# Altium schematic sheet fpga.SCHDOC: FPGA Parts
size A3; Organization: Berne University of Applied Science; Address1: School of Engineering and; Address2: Information Technology; Address3: Quellgasse 21; Address4: CH-2501 Biel; Revision: 1.0; SheetNumber: 2; SheetTotal: 19; ApprovedBy: zem1; Author: zac1
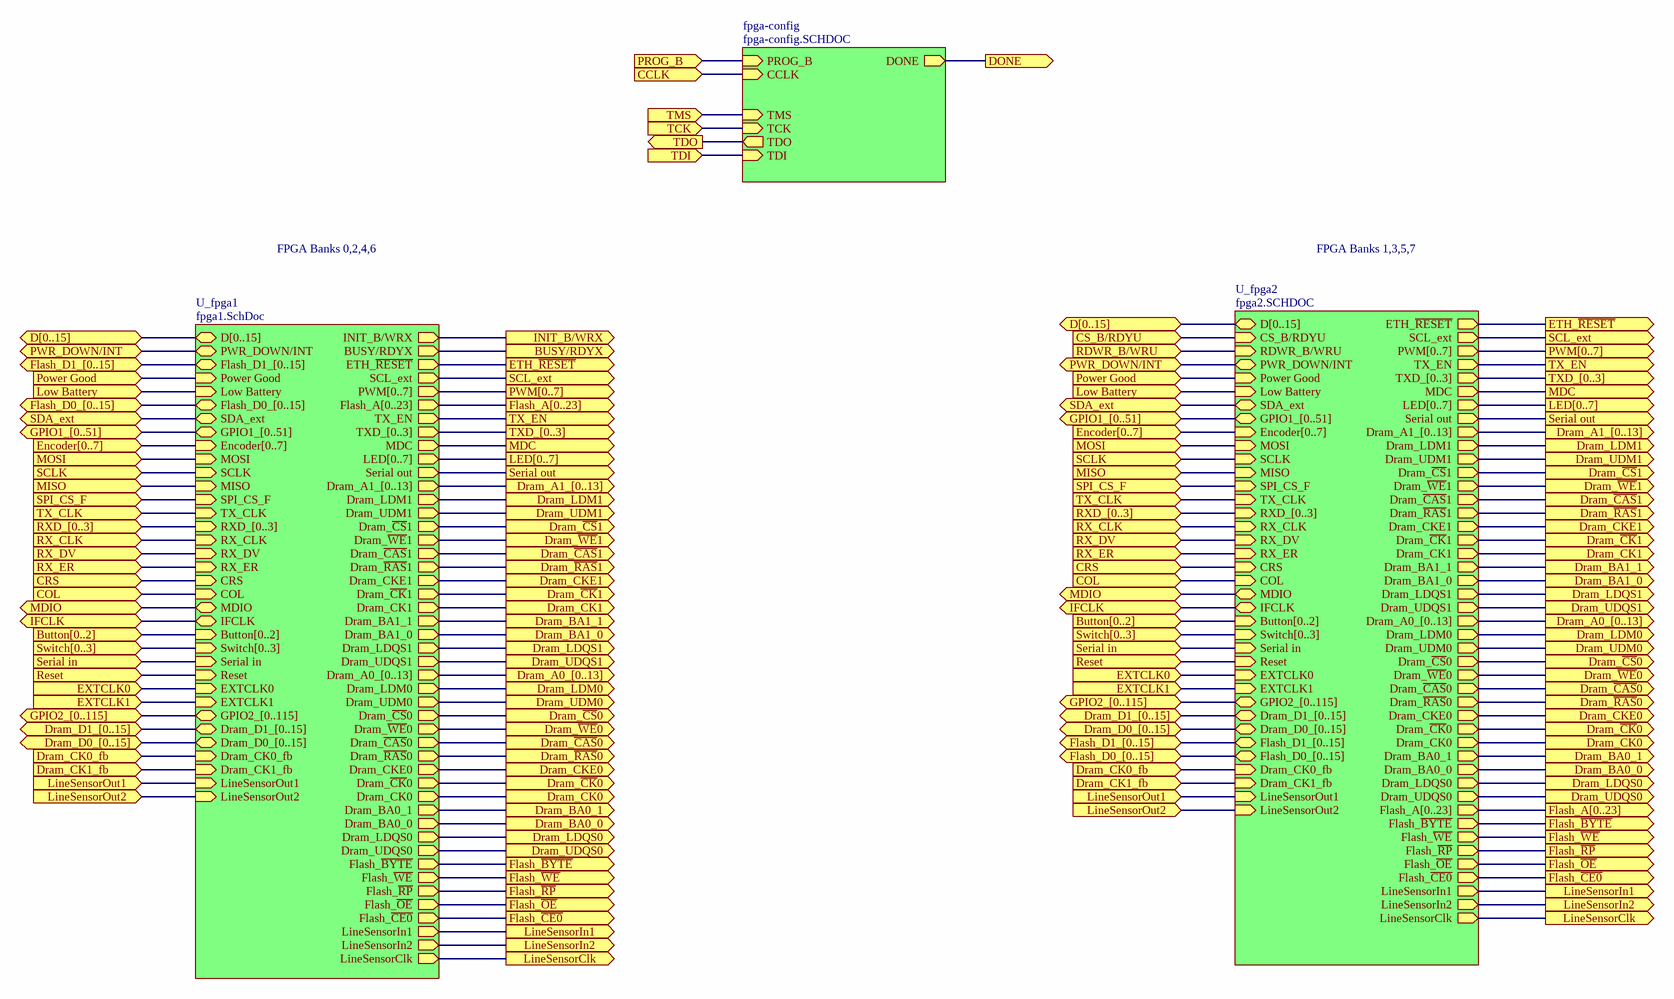
[diagram p0: fpga.SCHDOC]

## Sub-sheets
fpga-config = fpga-config.SCHDOC: DONE (out), PROG_B (in), CCLK (in), TCK (in), TDI (in), TMS (in), TDO (out)
U_fpga1 = fpga1.SchDoc: D[0..15] (bidir), INIT_B/WRX (out), BUSY/RDYX (out), PWR_DOWN/INT (bidir), ETH_~{RESET} (out), Flash_D1_[0..15] (bidir), Power Good (in), Low Battery (in), Flash_D0_[0..15] (bidir), SDA_ext (bidir), SCL_ext (out), PWM[0..7] (out), GPIO1_[0..51] (bidir), Encoder[0..7] (in), Flash_A[0..23] (out), MOSI (in), SCLK (in), MISO (in), SPI_CS_F (in), TX_CLK (in), RXD_[0..3] (in), RX_CLK (in), RX_DV (in), RX_ER (in), CRS (in), COL (in), TX_EN (out), TXD_[0..3] (out), MDC (out), MDIO (bidir), IFCLK (bidir), LED[0..7] (out), Button[0..2] (in), Switch[0..3] (in), Serial out (out), Serial in (in), Reset (in), EXTCLK0 (in), EXTCLK1 (in), GPIO2_[0..115] (bidir), Dram_D1_[0..15] (bidir), Dram_A1_[0..13] (out), Dram_LDM1 (out), Dram_UDM1 (out), Dram_~{CS}1 (out), Dram_~{WE}1 (out), Dram_~{CAS}1 (out), Dram_~{RAS}1 (out), Dram_CKE1 (out), Dram_~{CK}1 (out), Dram_CK1 (out), Dram_BA1_1 (out), Dram_BA1_0 (out), Dram_LDQS1 (out), Dram_UDQS1 (out), Dram_D0_[0..15] (bidir), Dram_A0_[0..13] (out), Dram_LDM0 (out), Dram_UDM0 (out), Dram_~{CS}0 (out), Dram_~{WE}0 (out), Dram_~{CAS}0 (out), Dram_~{RAS}0 (out), Dram_CKE0 (out), Dram_~{CK}0 (out), Dram_CK0 (out), Dram_BA0_1 (out), Dram_BA0_0 (out), Dram_LDQS0 (out), Dram_UDQS0 (out), Flash_~{BYTE} (out), Flash_~{WE} (out), Flash_~{RP} (out), Flash_~{OE} (out), Flash_~{CE0} (out), Dram_CK0_fb (in), Dram_CK1_fb (in), LineSensorOut2 (in), LineSensorOut1 (in), LineSensorIn1 (out), LineSensorIn2 (out), LineSensorClk (out)
U_fpga2 = fpga2.SCHDOC: D[0..15] (bidir), CS_B/RDYU (in), RDWR_B/WRU (in), PWR_DOWN/INT (bidir), ETH_~{RESET} (out), Power Good (in), Low Battery (in), SDA_ext (bidir), SCL_ext (out), PWM[0..7] (out), GPIO1_[0..51] (bidir), Encoder[0..7] (in), MOSI (in), SCLK (in), MISO (in), SPI_CS_F (in), TX_CLK (in), RXD_[0..3] (in), RX_CLK (in), RX_DV (in), RX_ER (in), CRS (in), COL (in), TX_EN (out), TXD_[0..3] (out), MDC (out), MDIO (bidir), IFCLK (bidir), LED[0..7] (out), Button[0..2] (in), Switch[0..3] (in), Serial out (out), Serial in (in), Reset (in), EXTCLK0 (in), EXTCLK1 (in), GPIO2_[0..115] (bidir), Dram_D1_[0..15] (bidir), Dram_A1_[0..13] (out), Dram_LDM1 (out), Dram_UDM1 (out), Dram_~{CS}1 (out), Dram_~{WE}1 (out), Dram_~{CAS}1 (out), Dram_~{RAS}1 (out), Dram_CKE1 (out), Dram_~{CK}1 (out), Dram_CK1 (out), Dram_BA1_1 (out), Dram_BA1_0 (out), Dram_LDQS1 (out), Dram_UDQS1 (out), Dram_D0_[0..15] (bidir), Dram_A0_[0..13] (out), Dram_LDM0 (out), Dram_UDM0 (out), Dram_~{CS}0 (out), Dram_~{WE}0 (out), Dram_~{CAS}0 (out), Dram_~{RAS}0 (out), Dram_CKE0 (out), Dram_~{CK}0 (out), Dram_CK0 (out), Dram_BA0_1 (out), Dram_BA0_0 (out), Dram_LDQS0 (out), Dram_UDQS0 (out), Flash_D1_[0..15] (bidir), Flash_D0_[0..15] (bidir), Flash_A[0..23] (out), Flash_~{BYTE} (out), Flash_~{WE} (out), Flash_~{RP} (out), Flash_~{OE} (out), Flash_~{CE0} (out), Dram_CK0_fb (in), Dram_CK1_fb (in), LineSensorIn1 (out), LineSensorIn2 (out), LineSensorClk (out), LineSensorOut2 (in), LineSensorOut1 (in)

## Ports
BUSY/RDYX (out), Button[0..2] (in), CCLK (in), COL (in), CRS (in), CS_B/RDYU (in), D[0..15] (bidir), DONE (out), Dram_A0_[0..13] (out), Dram_A1_[0..13] (out), Dram_BA0_0 (out), Dram_BA0_1 (out), Dram_BA1_0 (out), Dram_BA1_1 (out), Dram_CK0 (out), Dram_CK0_fb (in), Dram_CK1 (out), Dram_CK1_fb (in), Dram_CKE0 (out), Dram_CKE1 (out), Dram_D0_[0..15] (bidir), Dram_D1_[0..15] (bidir), Dram_LDM0 (out), Dram_LDM1 (out), Dram_LDQS0 (out), Dram_LDQS1 (out), Dram_UDM0 (out), Dram_UDM1 (out), Dram_UDQS0 (out), Dram_UDQS1 (out), Dram_~{CAS}0 (out), Dram_~{CAS}1 (out), Dram_~{CK}0 (out), Dram_~{CK}1 (out), Dram_~{CS}0 (out), Dram_~{CS}1 (out), Dram_~{RAS}0 (out), Dram_~{RAS}1 (out), Dram_~{WE}0 (out), Dram_~{WE}1 (out), Encoder[0..7] (in), ETH_~{RESET} (out), EXTCLK0 (in), EXTCLK1 (in), Flash_A[0..23] (out), Flash_D0_[0..15] (bidir), Flash_D1_[0..15] (bidir), Flash_~{BYTE} (out), Flash_~{CE0} (out), Flash_~{OE} (out), Flash_~{RP} (out), Flash_~{WE} (out), GPIO1_[0..51] (bidir), GPIO2_[0..115] (bidir), IFCLK (bidir), INIT_B/WRX (out), LED[0..7] (out), LineSensorClk (out), LineSensorIn1 (out), LineSensorIn2 (out), LineSensorOut1 (in), LineSensorOut2 (in), Low Battery (in), MDC (out), MDIO (bidir), MISO (in), MOSI (in), Power Good (in), PROG_B (in), PWM[0..7] (out), PWR_DOWN/INT (bidir), RDWR_B/WRU (in), Reset (in), RX_CLK (in), RX_DV (in), RX_ER (in), RXD_[0..3] (in), SCL_ext (out), SCLK (in), SDA_ext (bidir), Serial in (in), Serial out (out), SPI_CS_F (in), Switch[0..3] (in), TCK (in), TDI (in), TDO (out), TMS (in), TX_CLK (in), TX_EN (out), TXD_[0..3] (out)

## Nets
BUSY/RDYX: port BUSY/RDYX, sheet U_fpga1/BUSY/RDYX
CCLK: port CCLK, sheet fpga-config/CCLK
COL: port COL, sheet U_fpga1/COL, sheet U_fpga2/COL
CRS: port CRS, sheet U_fpga1/CRS, sheet U_fpga2/CRS
CS_B/RDYU: port CS_B/RDYU, sheet U_fpga2/CS_B/RDYU
DONE: port DONE, sheet fpga-config/DONE
Dram_BA0_0: port Dram_BA0_0, sheet U_fpga1/Dram_BA0_0, sheet U_fpga2/Dram_BA0_0
Dram_BA0_1: port Dram_BA0_1, sheet U_fpga1/Dram_BA0_1, sheet U_fpga2/Dram_BA0_1
Dram_BA1_0: port Dram_BA1_0, sheet U_fpga1/Dram_BA1_0, sheet U_fpga2/Dram_BA1_0
Dram_BA1_1: port Dram_BA1_1, sheet U_fpga1/Dram_BA1_1, sheet U_fpga2/Dram_BA1_1
Dram_~{CAS}0: port Dram_~{CAS}0, sheet U_fpga1/Dram_~{CAS}0, sheet U_fpga2/Dram_~{CAS}0
Dram_~{CAS}1: port Dram_~{CAS}1, sheet U_fpga1/Dram_~{CAS}1, sheet U_fpga2/Dram_~{CAS}1
Dram_~{CK}0: port Dram_~{CK}0, sheet U_fpga1/Dram_~{CK}0, sheet U_fpga2/Dram_~{CK}0
Dram_~{CK}1: port Dram_~{CK}1, sheet U_fpga1/Dram_~{CK}1, sheet U_fpga2/Dram_~{CK}1
Dram_~{CS}0: port Dram_~{CS}0, sheet U_fpga1/Dram_~{CS}0, sheet U_fpga2/Dram_~{CS}0
Dram_~{CS}1: port Dram_~{CS}1, sheet U_fpga1/Dram_~{CS}1, sheet U_fpga2/Dram_~{CS}1
Dram_CK0: port Dram_CK0, sheet U_fpga1/Dram_CK0, sheet U_fpga2/Dram_CK0
Dram_CK0_fb: port Dram_CK0_fb, sheet U_fpga1/Dram_CK0_fb, sheet U_fpga2/Dram_CK0_fb
Dram_CK1: port Dram_CK1, sheet U_fpga1/Dram_CK1, sheet U_fpga2/Dram_CK1
Dram_CK1_fb: port Dram_CK1_fb, sheet U_fpga1/Dram_CK1_fb, sheet U_fpga2/Dram_CK1_fb
Dram_CKE0: port Dram_CKE0, sheet U_fpga1/Dram_CKE0, sheet U_fpga2/Dram_CKE0
Dram_CKE1: port Dram_CKE1, sheet U_fpga1/Dram_CKE1, sheet U_fpga2/Dram_CKE1
Dram_LDM0: port Dram_LDM0, sheet U_fpga1/Dram_LDM0, sheet U_fpga2/Dram_LDM0
Dram_LDM1: port Dram_LDM1, sheet U_fpga1/Dram_LDM1, sheet U_fpga2/Dram_LDM1
Dram_LDQS0: port Dram_LDQS0, sheet U_fpga1/Dram_LDQS0, sheet U_fpga2/Dram_LDQS0
Dram_LDQS1: port Dram_LDQS1, sheet U_fpga1/Dram_LDQS1, sheet U_fpga2/Dram_LDQS1
Dram_~{RAS}0: port Dram_~{RAS}0, sheet U_fpga1/Dram_~{RAS}0, sheet U_fpga2/Dram_~{RAS}0
Dram_~{RAS}1: port Dram_~{RAS}1, sheet U_fpga1/Dram_~{RAS}1, sheet U_fpga2/Dram_~{RAS}1
Dram_UDM0: port Dram_UDM0, sheet U_fpga1/Dram_UDM0, sheet U_fpga2/Dram_UDM0
Dram_UDM1: port Dram_UDM1, sheet U_fpga1/Dram_UDM1, sheet U_fpga2/Dram_UDM1
Dram_UDQS0: port Dram_UDQS0, sheet U_fpga1/Dram_UDQS0, sheet U_fpga2/Dram_UDQS0
Dram_UDQS1: port Dram_UDQS1, sheet U_fpga1/Dram_UDQS1, sheet U_fpga2/Dram_UDQS1
Dram_~{WE}0: port Dram_~{WE}0, sheet U_fpga1/Dram_~{WE}0, sheet U_fpga2/Dram_~{WE}0
Dram_~{WE}1: port Dram_~{WE}1, sheet U_fpga1/Dram_~{WE}1, sheet U_fpga2/Dram_~{WE}1
ETH_~{RESET}: port ETH_~{RESET}, sheet U_fpga1/ETH_~{RESET}, sheet U_fpga2/ETH_~{RESET}
EXTCLK0: port EXTCLK0, sheet U_fpga1/EXTCLK0, sheet U_fpga2/EXTCLK0
EXTCLK1: port EXTCLK1, sheet U_fpga1/EXTCLK1, sheet U_fpga2/EXTCLK1
Flash_~{BYTE}: port Flash_~{BYTE}, sheet U_fpga1/Flash_~{BYTE}, sheet U_fpga2/Flash_~{BYTE}
Flash_~{CE0}: port Flash_~{CE0}, sheet U_fpga1/Flash_~{CE0}, sheet U_fpga2/Flash_~{CE0}
Flash_~{OE}: port Flash_~{OE}, sheet U_fpga1/Flash_~{OE}, sheet U_fpga2/Flash_~{OE}
Flash_~{RP}: port Flash_~{RP}, sheet U_fpga1/Flash_~{RP}, sheet U_fpga2/Flash_~{RP}
Flash_~{WE}: port Flash_~{WE}, sheet U_fpga1/Flash_~{WE}, sheet U_fpga2/Flash_~{WE}
IFCLK: port IFCLK, sheet U_fpga1/IFCLK, sheet U_fpga2/IFCLK
INIT_B/WRX: port INIT_B/WRX, sheet U_fpga1/INIT_B/WRX
LineSensorClk: port LineSensorClk, sheet U_fpga1/LineSensorClk, sheet U_fpga2/LineSensorClk
LineSensorIn1: port LineSensorIn1, sheet U_fpga1/LineSensorIn1, sheet U_fpga2/LineSensorIn1
LineSensorIn2: port LineSensorIn2, sheet U_fpga1/LineSensorIn2, sheet U_fpga2/LineSensorIn2
LineSensorOut1: port LineSensorOut1, sheet U_fpga1/LineSensorOut1, sheet U_fpga2/LineSensorOut1
LineSensorOut2: port LineSensorOut2, sheet U_fpga1/LineSensorOut2, sheet U_fpga2/LineSensorOut2
Low Battery: port Low Battery, sheet U_fpga1/Low Battery, sheet U_fpga2/Low Battery
MDC: port MDC, sheet U_fpga1/MDC, sheet U_fpga2/MDC
MDIO: port MDIO, sheet U_fpga1/MDIO, sheet U_fpga2/MDIO
MISO: port MISO, sheet U_fpga1/MISO, sheet U_fpga2/MISO
MOSI: port MOSI, sheet U_fpga1/MOSI, sheet U_fpga2/MOSI
Power Good: port Power Good, sheet U_fpga1/Power Good, sheet U_fpga2/Power Good
PROG_B: port PROG_B, sheet fpga-config/PROG_B
PWR_DOWN/INT: port PWR_DOWN/INT, sheet U_fpga1/PWR_DOWN/INT, sheet U_fpga2/PWR_DOWN/INT
RDWR_B/WRU: port RDWR_B/WRU, sheet U_fpga2/RDWR_B/WRU
Reset: port Reset, sheet U_fpga1/Reset, sheet U_fpga2/Reset
RX_CLK: port RX_CLK, sheet U_fpga1/RX_CLK, sheet U_fpga2/RX_CLK
RX_DV: port RX_DV, sheet U_fpga1/RX_DV, sheet U_fpga2/RX_DV
RX_ER: port RX_ER, sheet U_fpga1/RX_ER, sheet U_fpga2/RX_ER
SCL_ext: port SCL_ext, sheet U_fpga1/SCL_ext, sheet U_fpga2/SCL_ext
SCLK: port SCLK, sheet U_fpga1/SCLK, sheet U_fpga2/SCLK
SDA_ext: port SDA_ext, sheet U_fpga1/SDA_ext, sheet U_fpga2/SDA_ext
Serial in: port Serial in, sheet U_fpga1/Serial in, sheet U_fpga2/Serial in
Serial out: port Serial out, sheet U_fpga1/Serial out, sheet U_fpga2/Serial out
SPI_CS_F: port SPI_CS_F, sheet U_fpga1/SPI_CS_F, sheet U_fpga2/SPI_CS_F
TCK: port TCK, sheet fpga-config/TCK
TDI: port TDI, sheet fpga-config/TDI
TDO: port TDO, sheet fpga-config/TDO
TMS: port TMS, sheet fpga-config/TMS
TX_CLK: port TX_CLK, sheet U_fpga1/TX_CLK, sheet U_fpga2/TX_CLK
TX_EN: port TX_EN, sheet U_fpga1/TX_EN, sheet U_fpga2/TX_EN

## Buses and harness runs
bus port Button[0..2] = sheet U_fpga1/Button[0..2]
bus port Button[0..2] = sheet U_fpga2/Button[0..2]
bus port D[0..15] = sheet U_fpga1/D[0..15]
bus port D[0..15] = sheet U_fpga2/D[0..15]
bus port Dram_A0_[0..13] = sheet U_fpga1/Dram_A0_[0..13]
bus port Dram_A0_[0..13] = sheet U_fpga2/Dram_A0_[0..13]
bus port Dram_A1_[0..13] = sheet U_fpga1/Dram_A1_[0..13]
bus port Dram_A1_[0..13] = sheet U_fpga2/Dram_A1_[0..13]
bus port Dram_D0_[0..15] = sheet U_fpga1/Dram_D0_[0..15]
bus port Dram_D0_[0..15] = sheet U_fpga2/Dram_D0_[0..15]
bus port Dram_D1_[0..15] = sheet U_fpga1/Dram_D1_[0..15]
bus port Dram_D1_[0..15] = sheet U_fpga2/Dram_D1_[0..15]
bus port Encoder[0..7] = sheet U_fpga1/Encoder[0..7]
bus port Encoder[0..7] = sheet U_fpga2/Encoder[0..7]
bus port Flash_A[0..23] = sheet U_fpga1/Flash_A[0..23]
bus port Flash_A[0..23] = sheet U_fpga2/Flash_A[0..23]
bus port Flash_D0_[0..15] = sheet U_fpga1/Flash_D0_[0..15]
bus port Flash_D0_[0..15] = sheet U_fpga2/Flash_D0_[0..15]
bus port Flash_D1_[0..15] = sheet U_fpga1/Flash_D1_[0..15]
bus port Flash_D1_[0..15] = sheet U_fpga2/Flash_D1_[0..15]
bus port GPIO1_[0..51] = sheet U_fpga1/GPIO1_[0..51]
bus port GPIO1_[0..51] = sheet U_fpga2/GPIO1_[0..51]
bus port GPIO2_[0..115] = sheet U_fpga1/GPIO2_[0..115]
bus port GPIO2_[0..115] = sheet U_fpga2/GPIO2_[0..115]
bus port LED[0..7] = sheet U_fpga1/LED[0..7]
bus port LED[0..7] = sheet U_fpga2/LED[0..7]
bus port PWM[0..7] = sheet U_fpga1/PWM[0..7]
bus port PWM[0..7] = sheet U_fpga2/PWM[0..7]
bus port RXD_[0..3] = sheet U_fpga1/RXD_[0..3]
bus port RXD_[0..3] = sheet U_fpga2/RXD_[0..3]
bus port Switch[0..3] = sheet U_fpga1/Switch[0..3]
bus port Switch[0..3] = sheet U_fpga2/Switch[0..3]
bus port TXD_[0..3] = sheet U_fpga1/TXD_[0..3]
bus port TXD_[0..3] = sheet U_fpga2/TXD_[0..3]

## Notes on the sheet
- FPGA Banks 0,2,4,6
- FPGA Banks 1,3,5,7
- Title:
- Size:
- Date:
- A3_L
- Author:
- Time:
- Revision:
- Sheet
- of
- File: